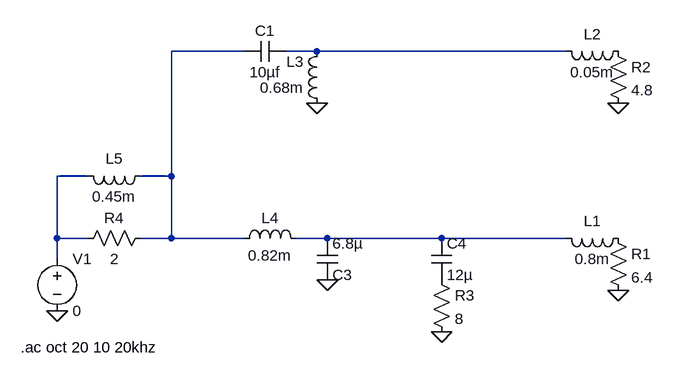
[diagram p0: schematic cygnet mkii xo.asc]
cygnet mkii xo.asc, the LTspice schematic file:
Version 4
SHEET 1 880 680
WIRE 48 128 -64 128
WIRE 160 128 112 128
WIRE 544 128 160 128
WIRE -192 320 -240 320
WIRE -64 320 -64 128
WIRE -64 320 -112 320
WIRE -240 416 -240 320
WIRE -192 416 -240 416
WIRE -64 416 -64 320
WIRE -64 416 -112 416
WIRE 48 416 -64 416
WIRE 176 416 128 416
WIRE 352 416 176 416
WIRE 544 416 352 416
WIRE -240 448 -240 416
FLAG 624 208 0
FLAG 624 496 0
FLAG -240 528 0
FLAG 160 208 0
FLAG 176 480 0
FLAG 352 560 0
SYMBOL voltage -240 432 R0
SYMATTR InstName V1
SYMATTR Value 0
SYMATTR Value2 AC 1
SYMBOL ind 640 400 R90
WINDOW 0 5 56 VBottom 2
WINDOW 3 32 56 VTop 2
SYMATTR InstName L1
SYMATTR Value 0.8m
SYMBOL ind 640 112 R90
WINDOW 0 5 56 VBottom 2
WINDOW 3 32 56 VTop 2
SYMATTR InstName L2
SYMATTR Value 0.05m
SYMBOL res 608 400 R0
SYMATTR InstName R1
SYMATTR Value 6.4
SYMBOL res 608 112 R0
SYMATTR InstName R2
SYMATTR Value 4.8
SYMBOL cap 112 112 R90
WINDOW 0 0 32 VBottom 2
WINDOW 3 32 32 VTop 2
SYMATTR InstName C1
SYMATTR Value 10µf
SYMBOL cap 160 416 R0
WINDOW 0 24 56 Left 2
WINDOW 3 24 8 Left 2
SYMATTR InstName C3
SYMATTR Value 6.8µ
SYMBOL ind 176 224 R180
WINDOW 0 36 80 Left 2
WINDOW 3 36 40 Left 2
SYMATTR InstName L3
SYMATTR Value 0.68m
SYMBOL ind 32 432 R270
WINDOW 0 32 56 VTop 2
WINDOW 3 5 56 VBottom 2
SYMATTR InstName L4
SYMATTR Value 0.82m
SYMBOL cap 336 416 R0
SYMATTR InstName C4
SYMATTR Value 12µ
SYMBOL res 336 464 R0
SYMATTR InstName R3
SYMATTR Value 8
SYMBOL ind -96 304 R90
WINDOW 0 5 56 VBottom 2
WINDOW 3 32 56 VTop 2
SYMATTR InstName L5
SYMATTR Value 0.45m
SYMBOL res -96 400 R90
WINDOW 0 0 56 VBottom 2
WINDOW 3 32 56 VTop 2
SYMATTR InstName R4
SYMATTR Value 2
TEXT -296 584 Left 2 !.ac oct 20 10 20khz

The netlist it stands for:
* cygnet mkii xo.asc
V1 N003 0 0 AC 1
L1 P001 N004 0.8m
L2 P002 N002 0.05m
R1 P001 0 6.4
R2 P002 0 4.8
C1 N002 N001 10µf
C3 N004 0 6.8µ
L3 0 N002 0.68m
L4 N001 N004 0.82m
C4 N004 P003 12µ
R3 P003 0 8
L5 N001 N003 0.45m
R4 N001 N003 2
.ac oct 20 10 20khz
.backanno
.end